# Altium project 8-Solenoid-PCB.PrjPcb
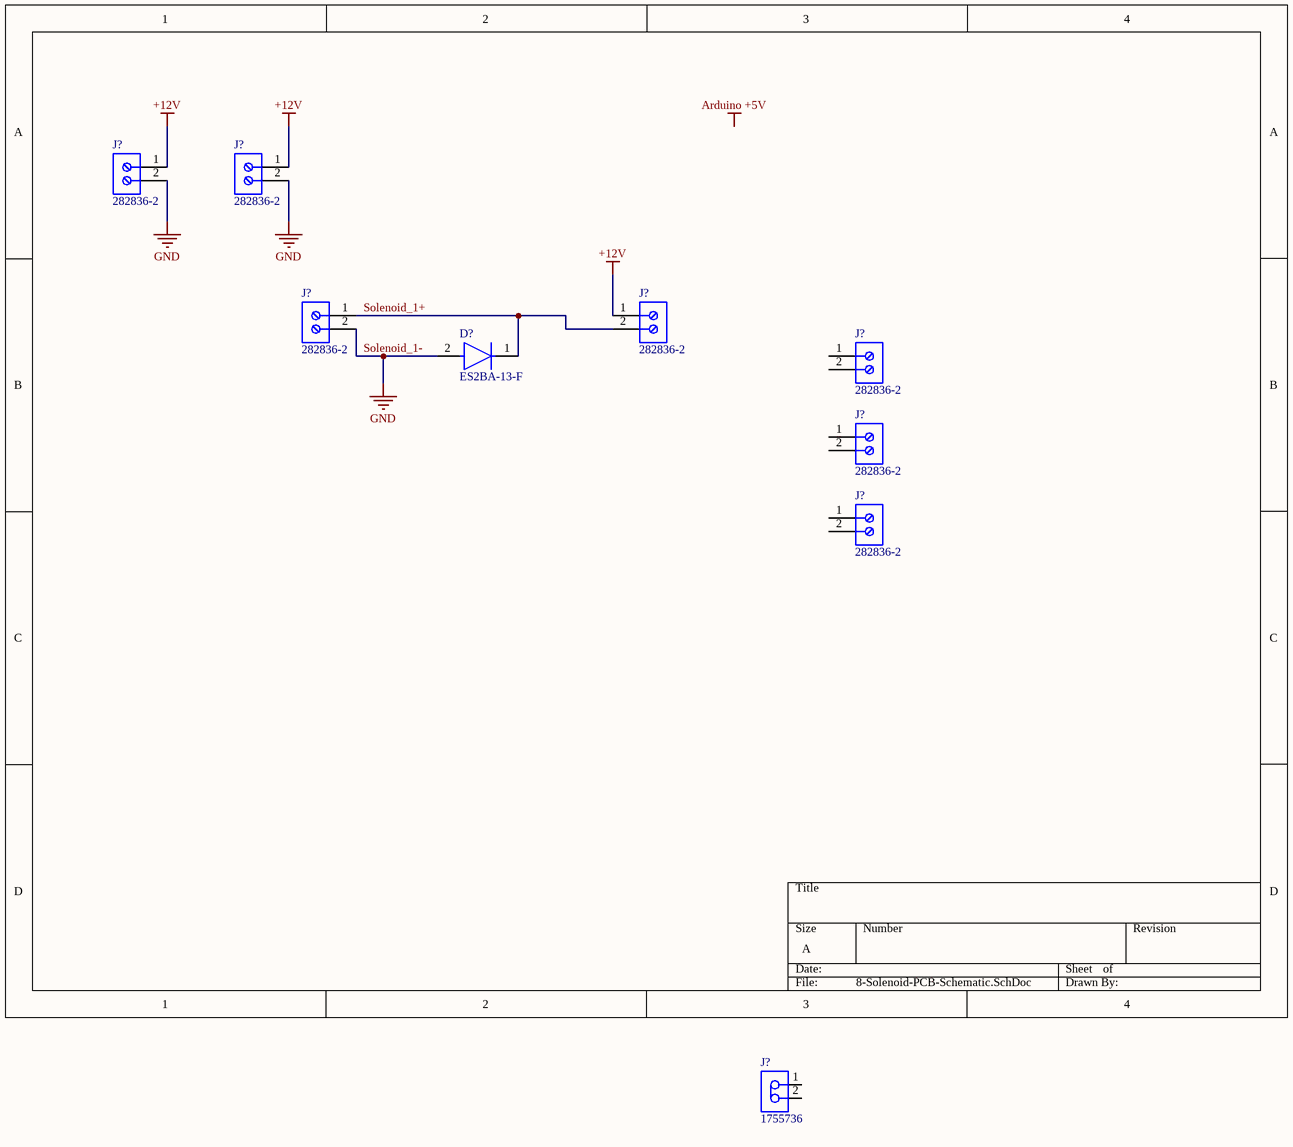
[diagram p0: 8-Solenoid-PCB-Schematic.SchDoc]
1 sheet, 9 parts. Net scope: global (net labels, ports and power ports of the same name join across sheets).
Board file: PCB1.PcbDoc

## Sheet 8-Solenoid-PCB-Schematic.SchDoc
size A; SheetNumber: 1; SheetTotal: 1

### Parts
(Parts that share a designator on the sheet are numbered #1, #2 ... from top to bottom, then left to right.)
D?  ES2BA-13-F  [FP-SMA-MFG]
J?#1  282836-2  [TECO-282836-2_V]
J?#2  282836-2  [TECO-282836-2_V]
J?#3  282836-2  [TECO-282836-2_V]
J?#4  282836-2  [TECO-282836-2_V]
J?#5  282836-2  [TECO-282836-2_V]
J?#6  282836-2  [TECO-282836-2_V]
J?#7  282836-2  [TECO-282836-2_V]
J?#8  1755736  [PHOE-1755736-2_V]

### Nets
+12V: J?#1.1 J?#2.1 J?#4.1
Solenoid_1-: D?.2(A) J?#1.2 J?#2.2 J?#3.2  [also labelled GND]
Solenoid_1+: D?.1(C) J?#3.1 J?#4.2

Not connected (* = marked no-connect by the designer): J?#5 1 2; J?#6 1 2; J?#7 1 2; J?#8 1 2

### Notes on the sheet
- Labels drawn without touching a wire or pin: Arduino +5V

### Library data of the parts
D? = CMP-12791-000037-1: DIODE GEN PURP 100V 2A SMA; Manufacturer: Diodes Inc.; Standoff Height: 0.05mm; Description: Diode Standard 100V 2A Surface Mount SMA; Value: 25pF; Peak Reverse Current: 5uA; Max Junction Temp: +150°C; Max Surge Forward Current: 50A; Digikey Description: DIODE GEN PURP 100V 2A SMA; Max Repetitive Reverse Voltage: 100V; Mouser Description: ES2BA Series 100 V 2 A Surface Mount Super-Fast Rectifier - DO-214AC; RoHS: TRUE; Device Class L3: Rectifier Diodes; Height: 2.4mm; Footprint Url: https://www.diodes.com/assets/Package-Files/SMA.pdf; Lead Free: Yes; Device Class L1: Discrete Semiconductors; Forward Current: 2A; ComponentLink2Description: Datasheet; Manufacturer Part Number: ES2BA-13-F; Temperature: -55°C to +150°C; Temperature Range Low: -55°C; Automotive: No; Device Class L2: Diodes; Category: Diode; Octopart: https://octopart.com/es2ba-13-f-diodes+inc.-14402013; Package: SMA; Capacitance: 25pF; ComponentLink2URL: https://www.diodes.com/assets/Datasheets/ds14002.pdf; Reverse Voltage: 100V; Temperature Range High: +150°C
J?#1-J?#7 = CMP-1684-00017-1: Female Header, Pitch 5 mm, 1 x 2 Position, Height 10 mm, Tail Length 3.5 mm, Rohs, Bulk; Manufacturer: TE Connectivity; Wire Gauge: 16-30AWG; Product Training Modules: Wire-to-BoardEurostyleTerminalBlocks; Clamp Material - Plating: Brass-NickelPlated; Voltage: 300V; Mating Orientation: HorizontalwithBoard; Current: 13.5A; Pitch: 0.197"(5.00mm); Screw Thread: M3; 3D Model: 282836-2.pdf; Other Names: 5ULV-02B / A98076; Dynamic Catalog: BuchananSeries; Number of Levels: 1; Torque - Screw: 0.68Nm(6Lb-In); Featured Product: EurostyleTerminalBlockConnectors; Positions Per Level: 2; Wire Termination: Screw-RisingCageClamp; Datasheet URL: http://www.te.com.cn/commerce/DocumentDelivery/DDEController?Action=showdoc&DocId=Catalog+Section%7F1308389_EUROSTYLE_TERMINAL_BLOCKS%7F0607%7Fpdf%7FEnglish%7FENG_CS_1308389_EUROSTYLE_TERMINAL_BLOCKS_0607.pdf%7F282836-2; Color: Green; Family: TerminalBlocks-WiretoBoard; RoHS Information: 282836-2StatementofCompliance; Standard Package: 300; Contact Material - Plating: Brass-TinPlated; Manufacturer URL: http://www.te.com; Housing Material: Polyamide(PA66),Nylon6/6; Features: Interlocking(Side); Package Description: Female Header, Pitch 5 mm, 1 x 2 Position, Height 10 mm, Tail Length 3.5 mm; Mounting Type: ThroughHole; Package Reference: THD; Packaging: Bulk; Series: Buchanan; Category: Connectors,Interconnects; Screw Material - Plating: Brass-NickelPlated
J?#8 = CMP-2000-05300-1: Male Header, Pitch 5.08 mm, 1 x 2 Postion, Height 12 mm, Tail Length 3.9 mm, RoHS, Bulk; Manufacturer: Phoenix Contact; Content: 250pc(s); Pitch: 5.08mm; Industrial packaging: Yes; Number of contacts: 2; Manufacturer URL: http://www.phoenixcontact.com/; Datasheet Version: Apr-16; Datasheet URL: http://www.mouser.com/ds/2/324/ItemDetail_1755736-921028.pdf; Manufacturer part No.: 1755736; Type: MSTBVA2,5/2-G-5,08; Colour: Green